# Altium schematic sheet Main.SchDoc
size 711 x 762 mm; SheetNumber: 1; SheetTotal: 1
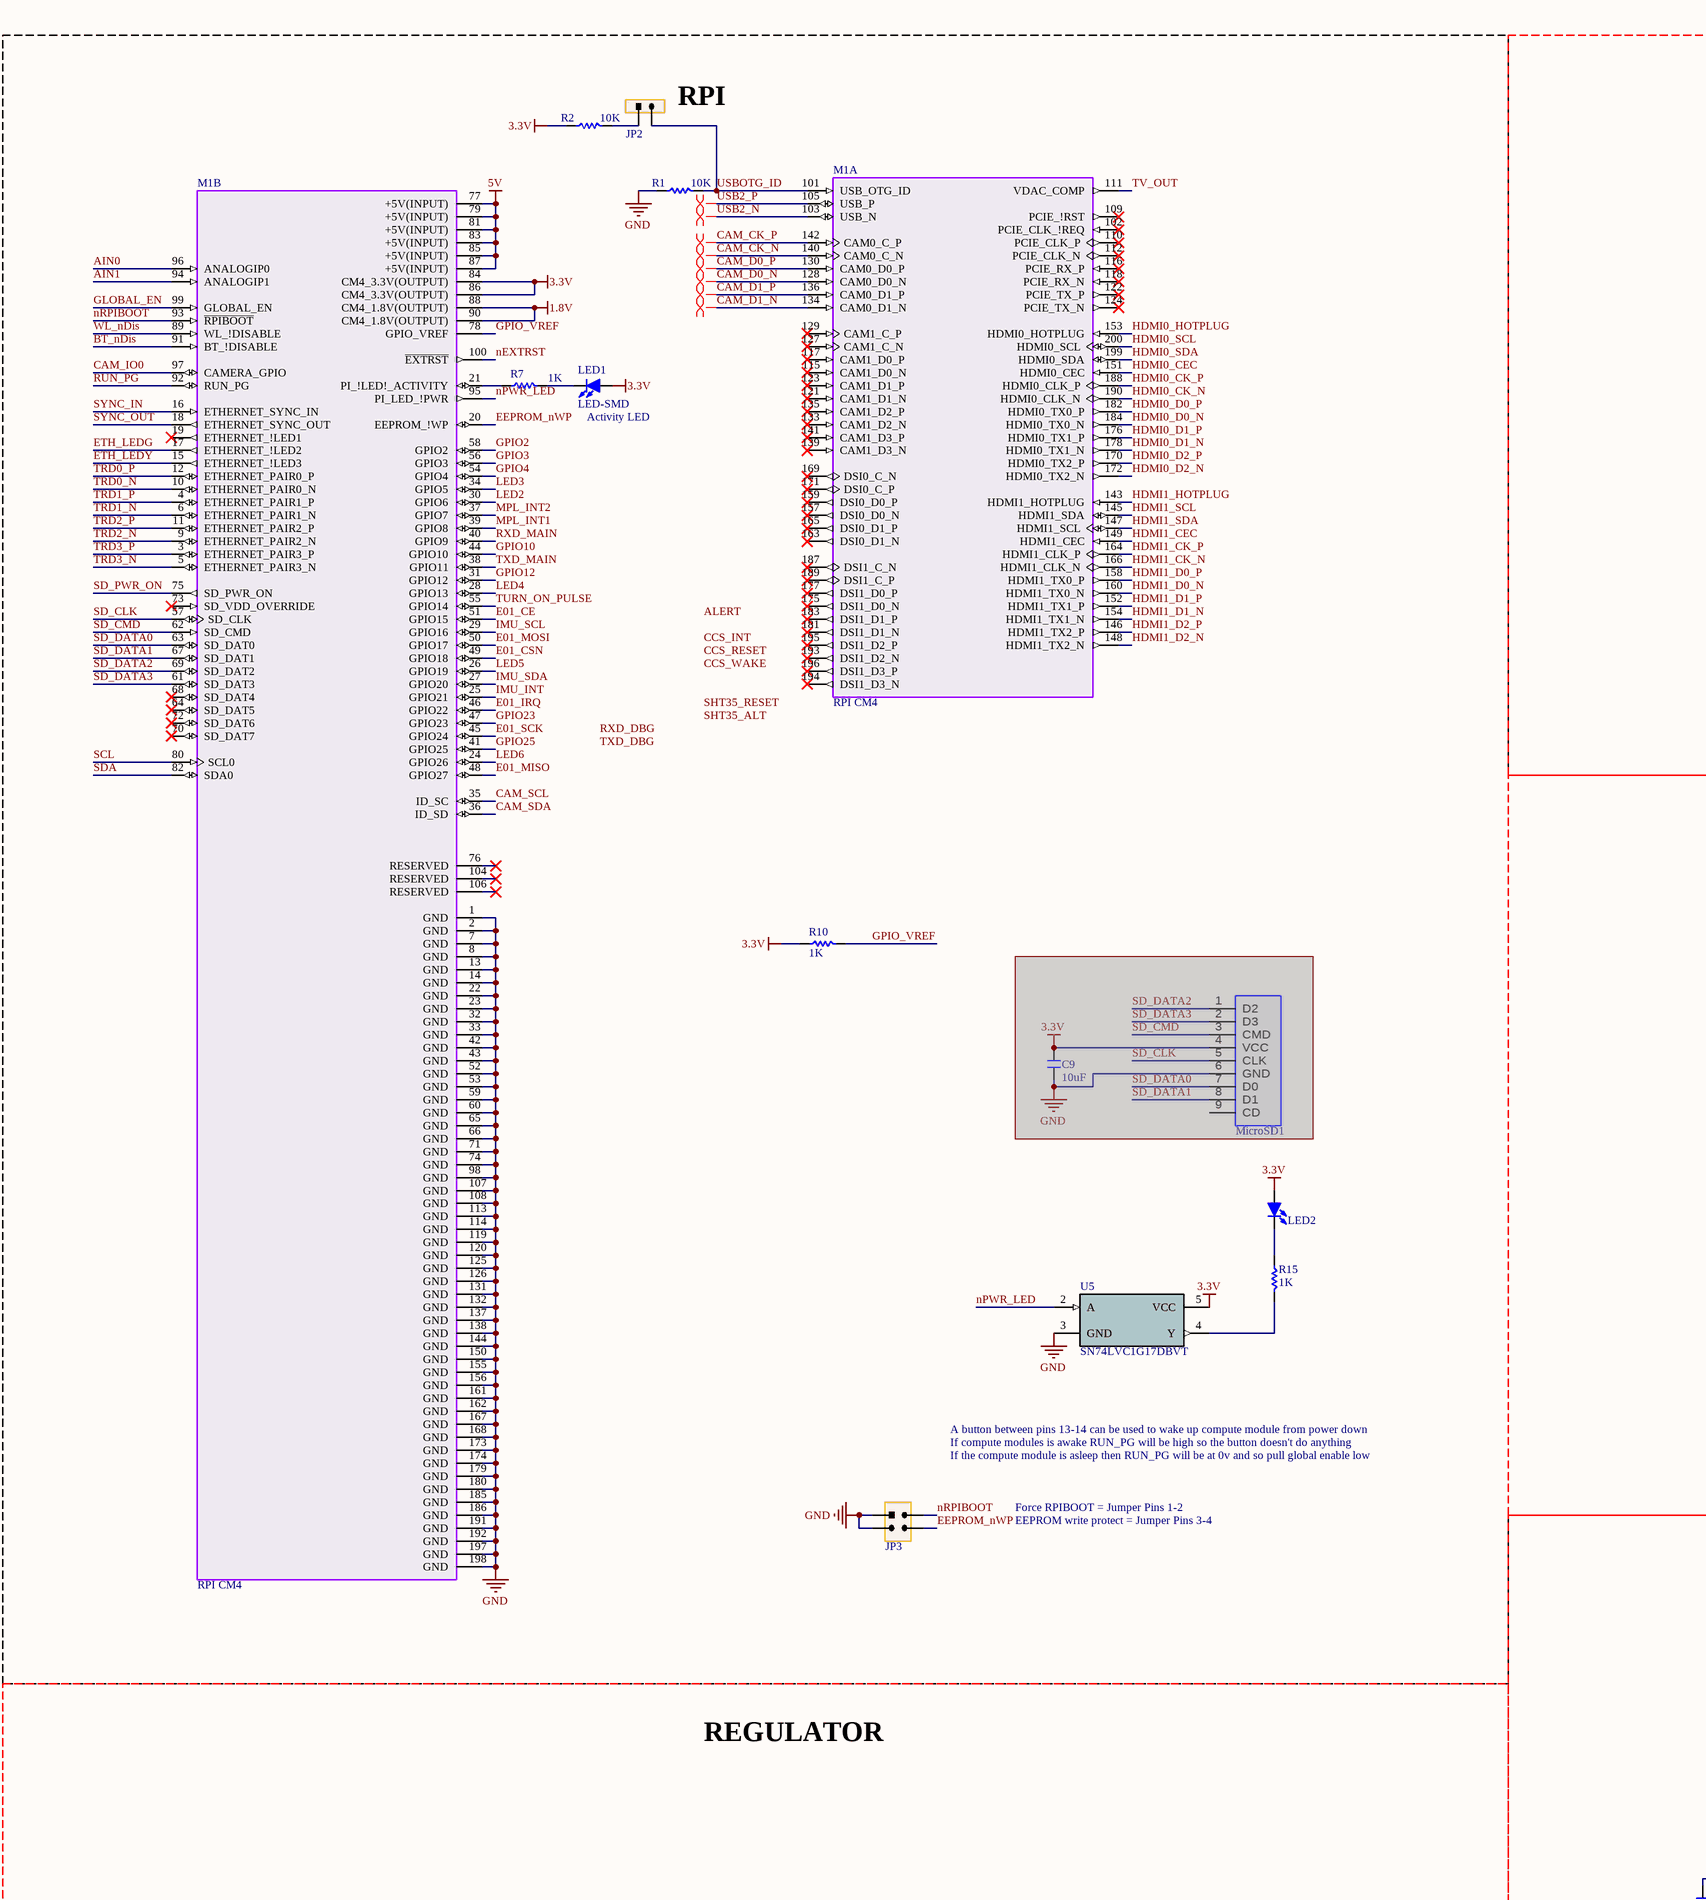
[diagram p0: Main.SchDoc, top left]
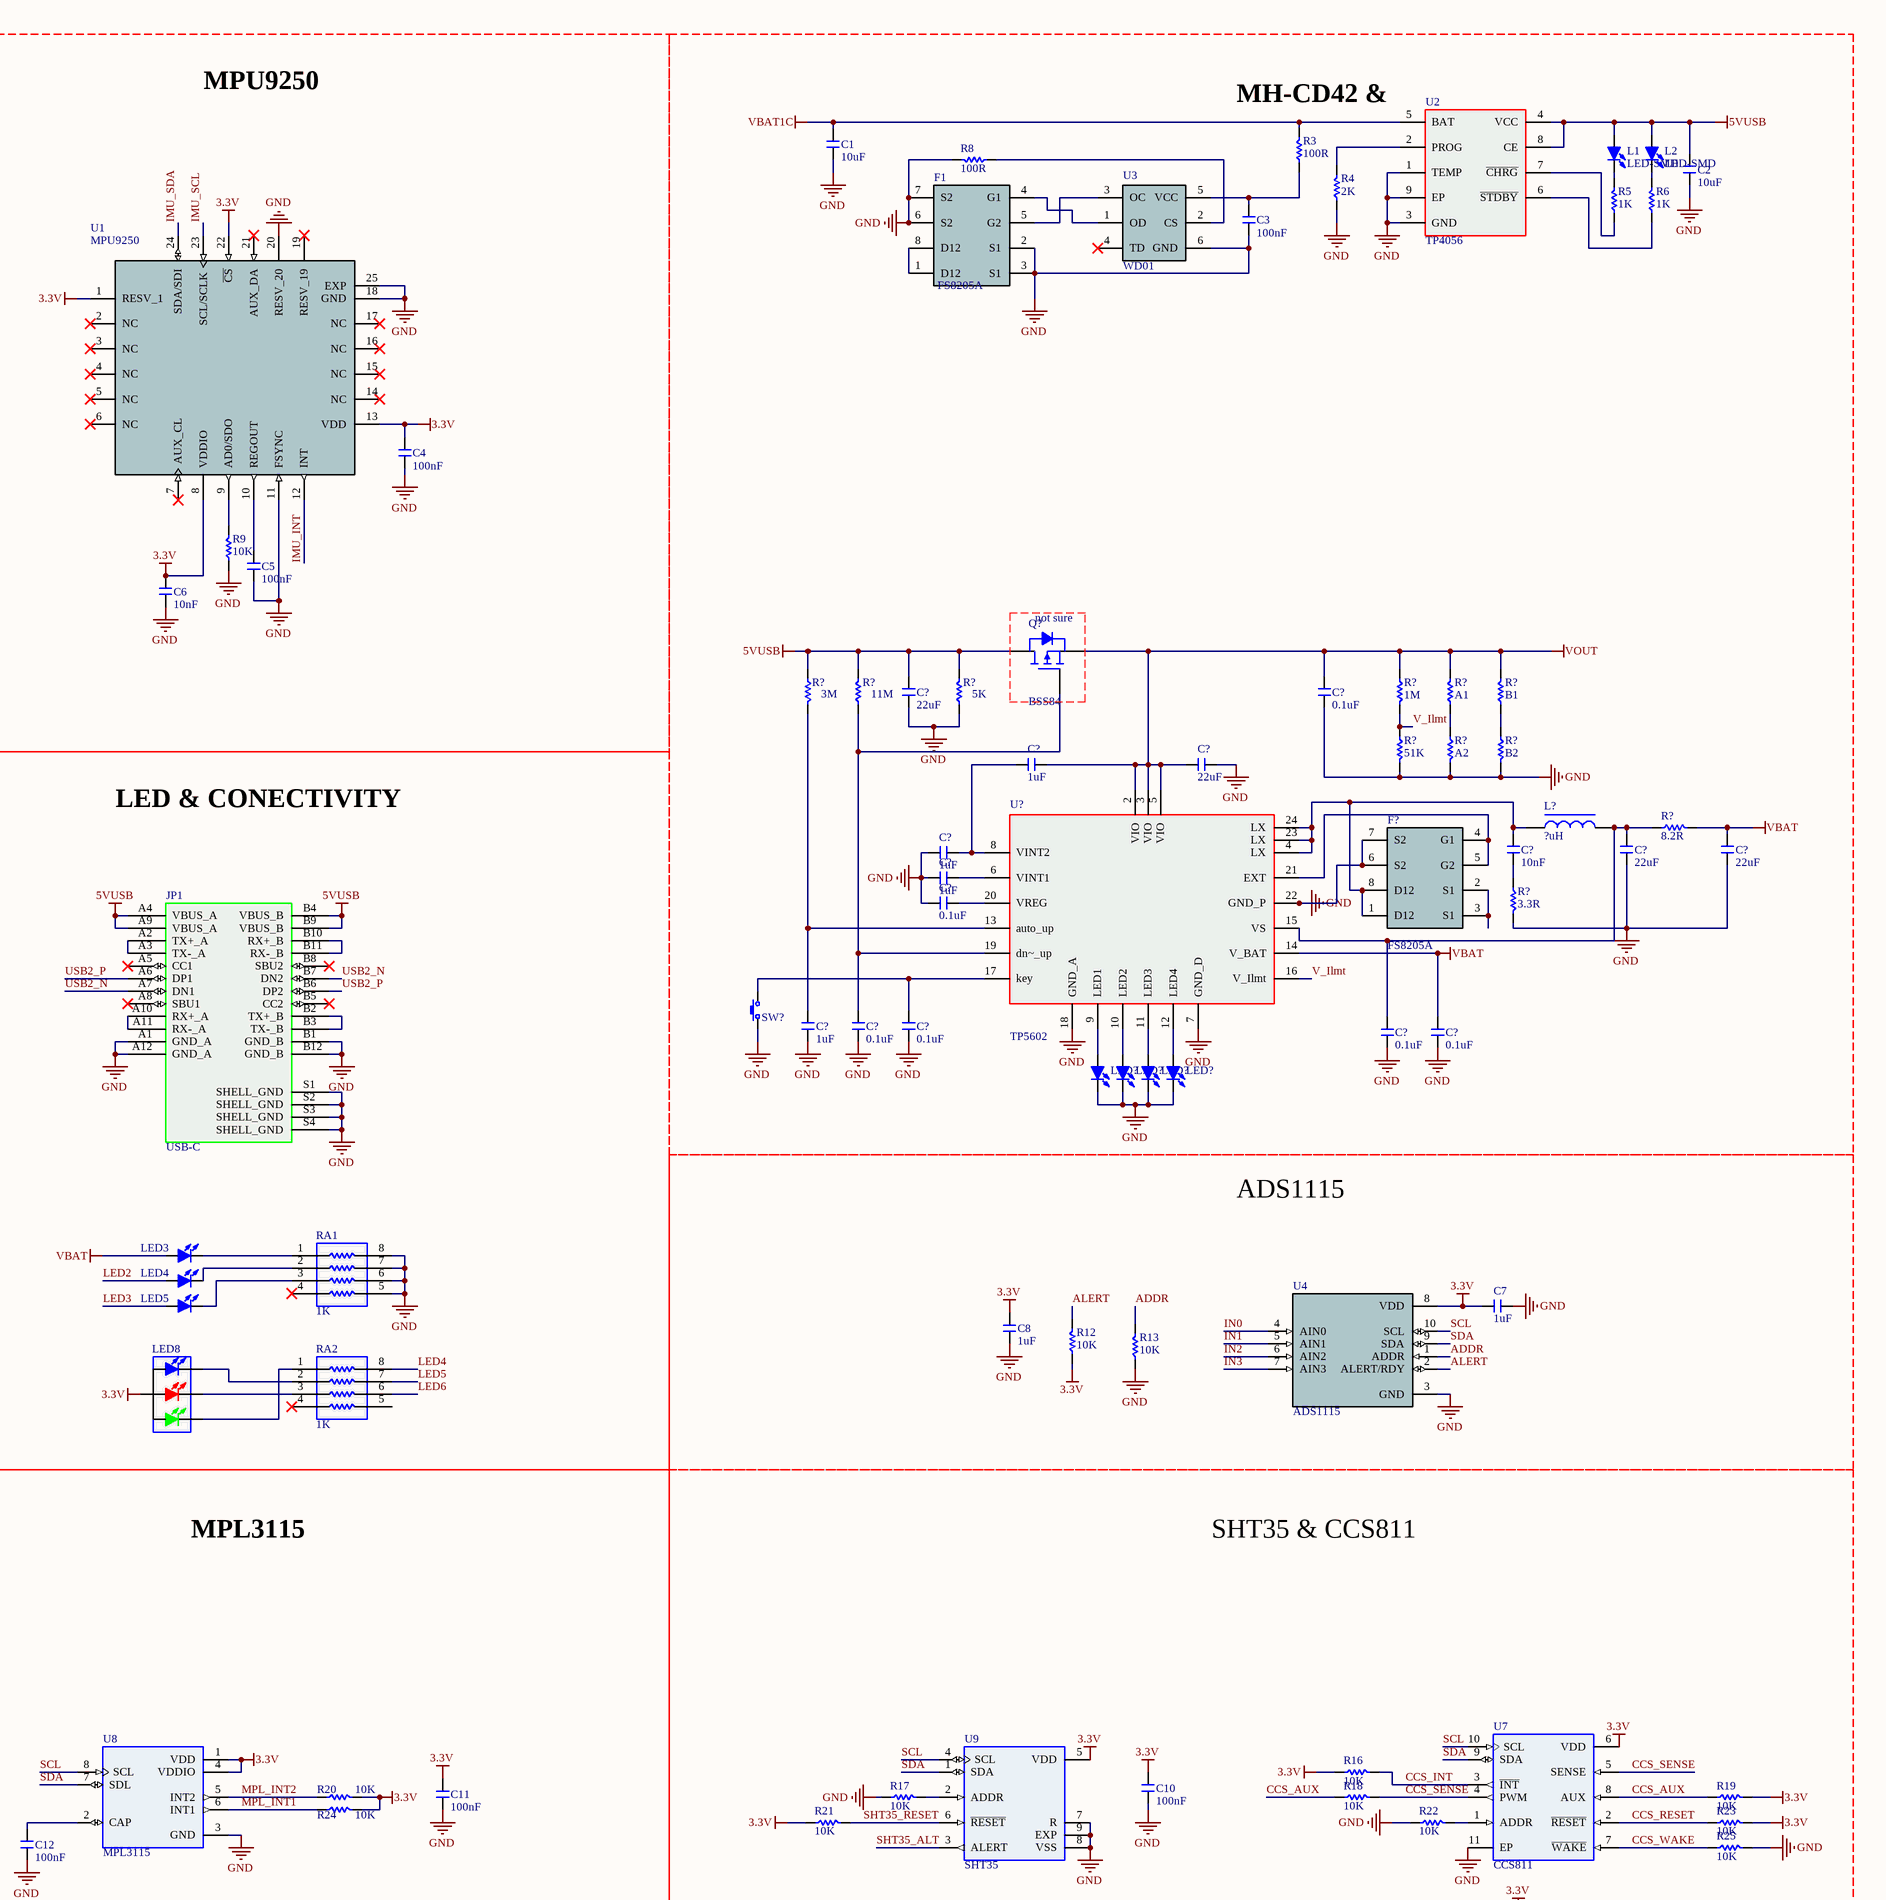
[diagram p1: Main.SchDoc, top right]
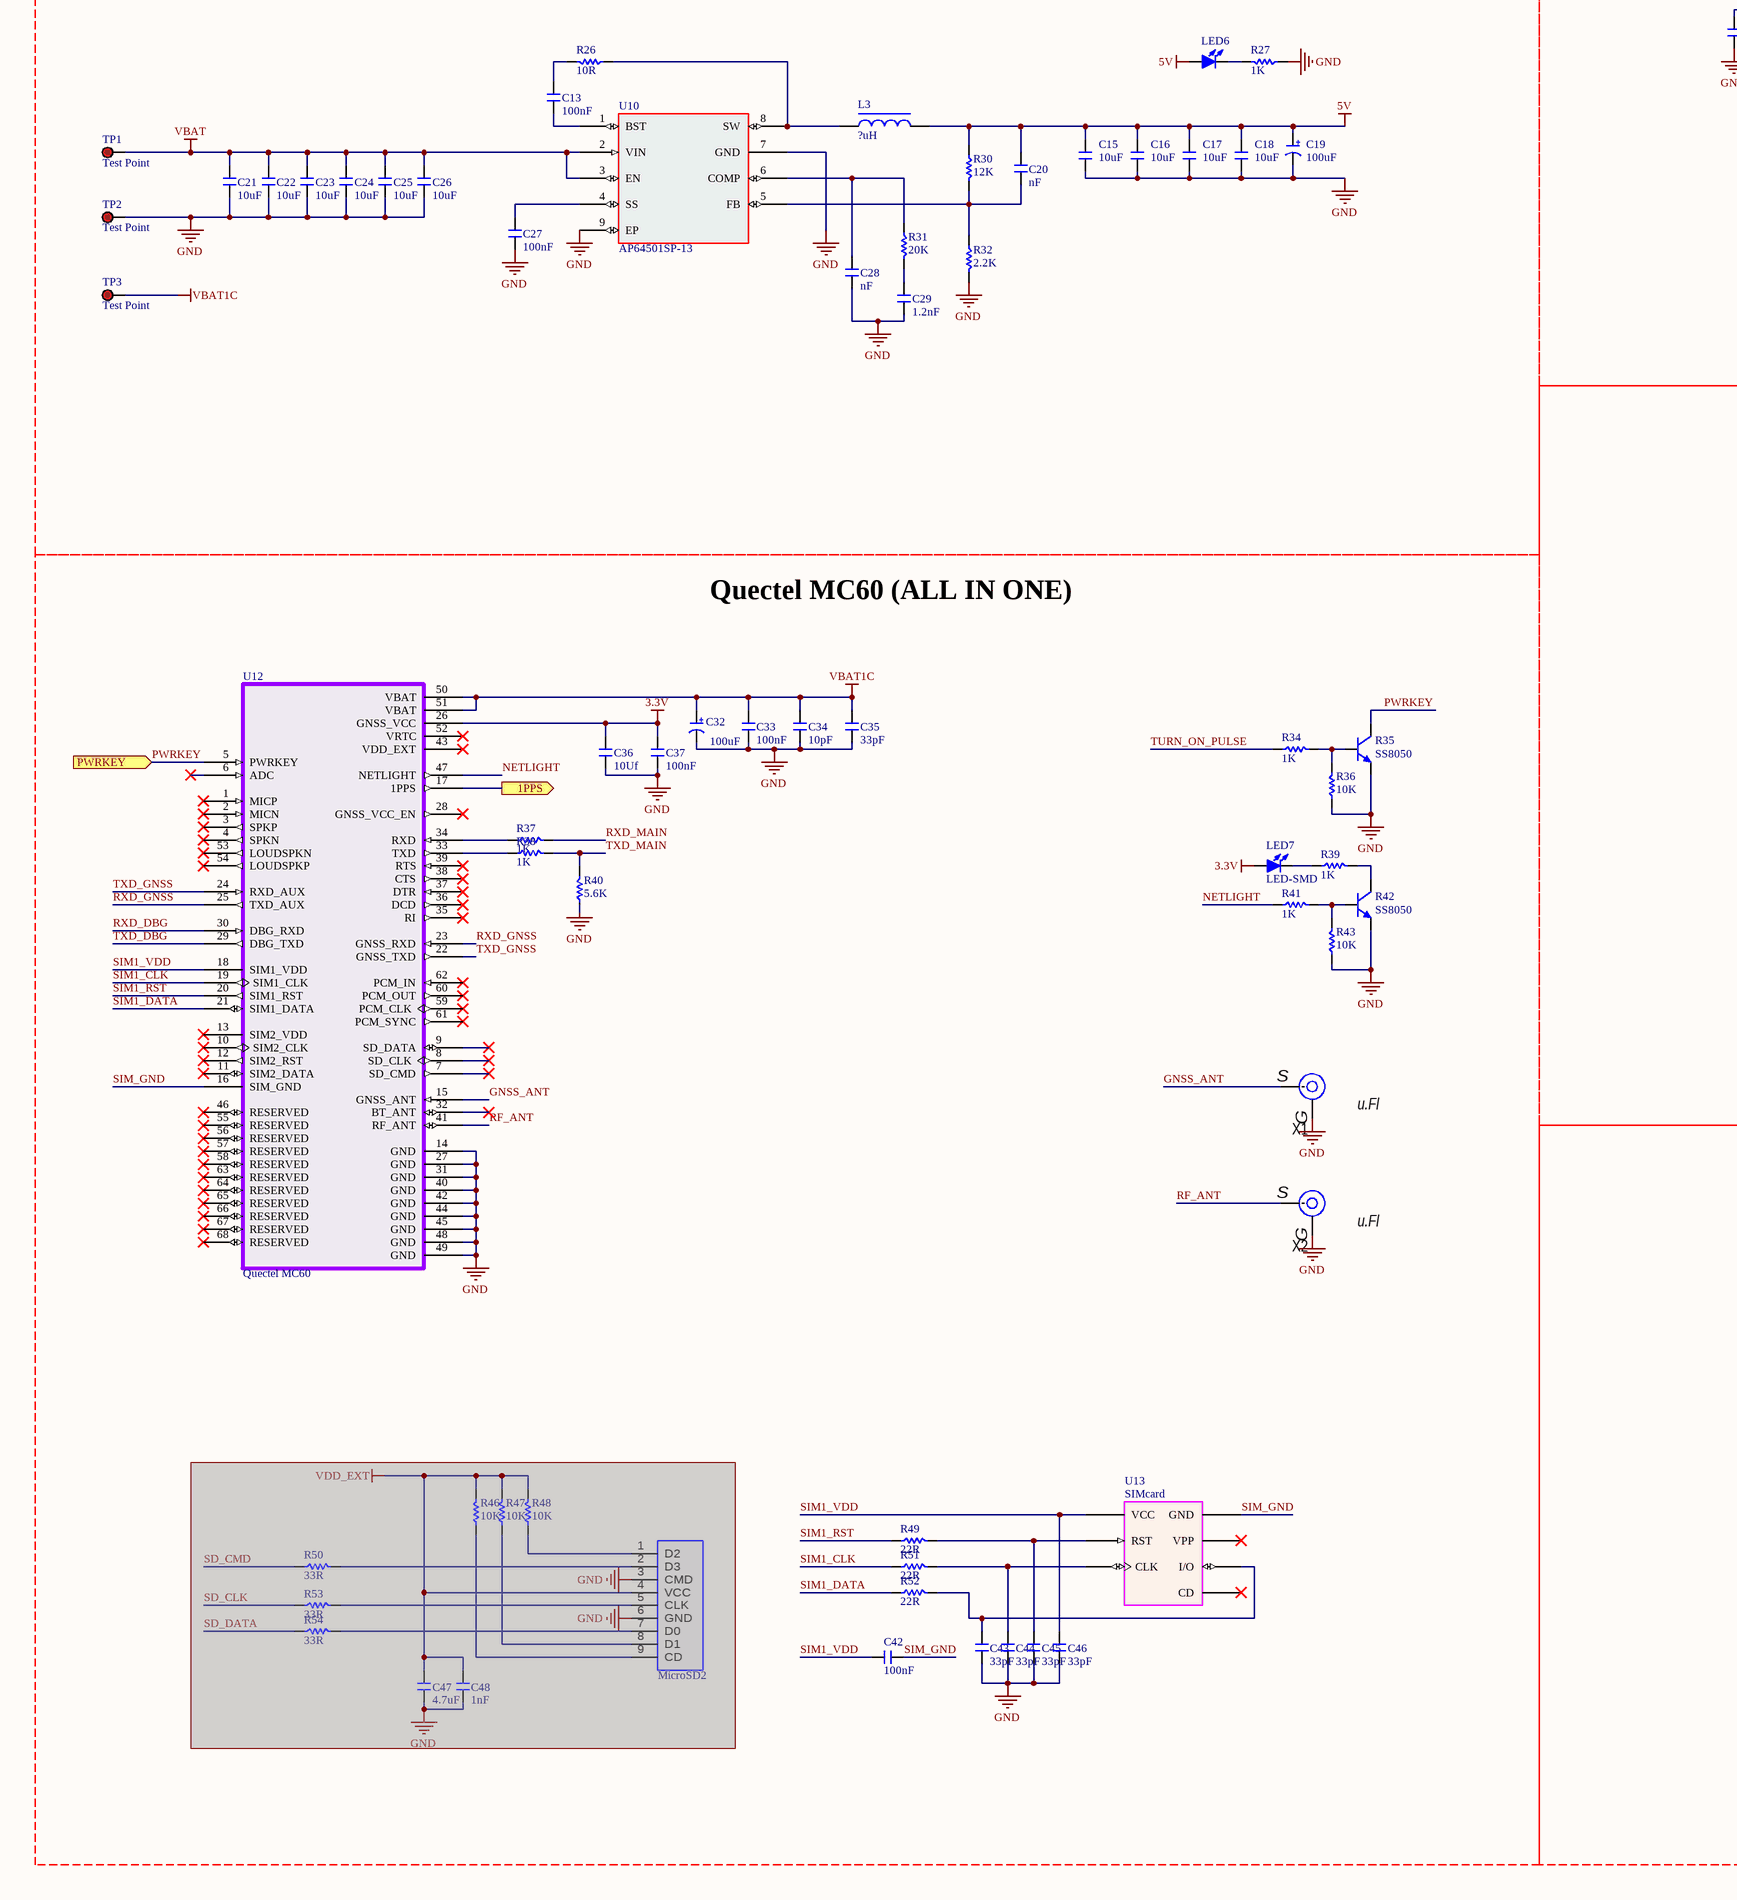
[diagram p2: Main.SchDoc, bottom left]
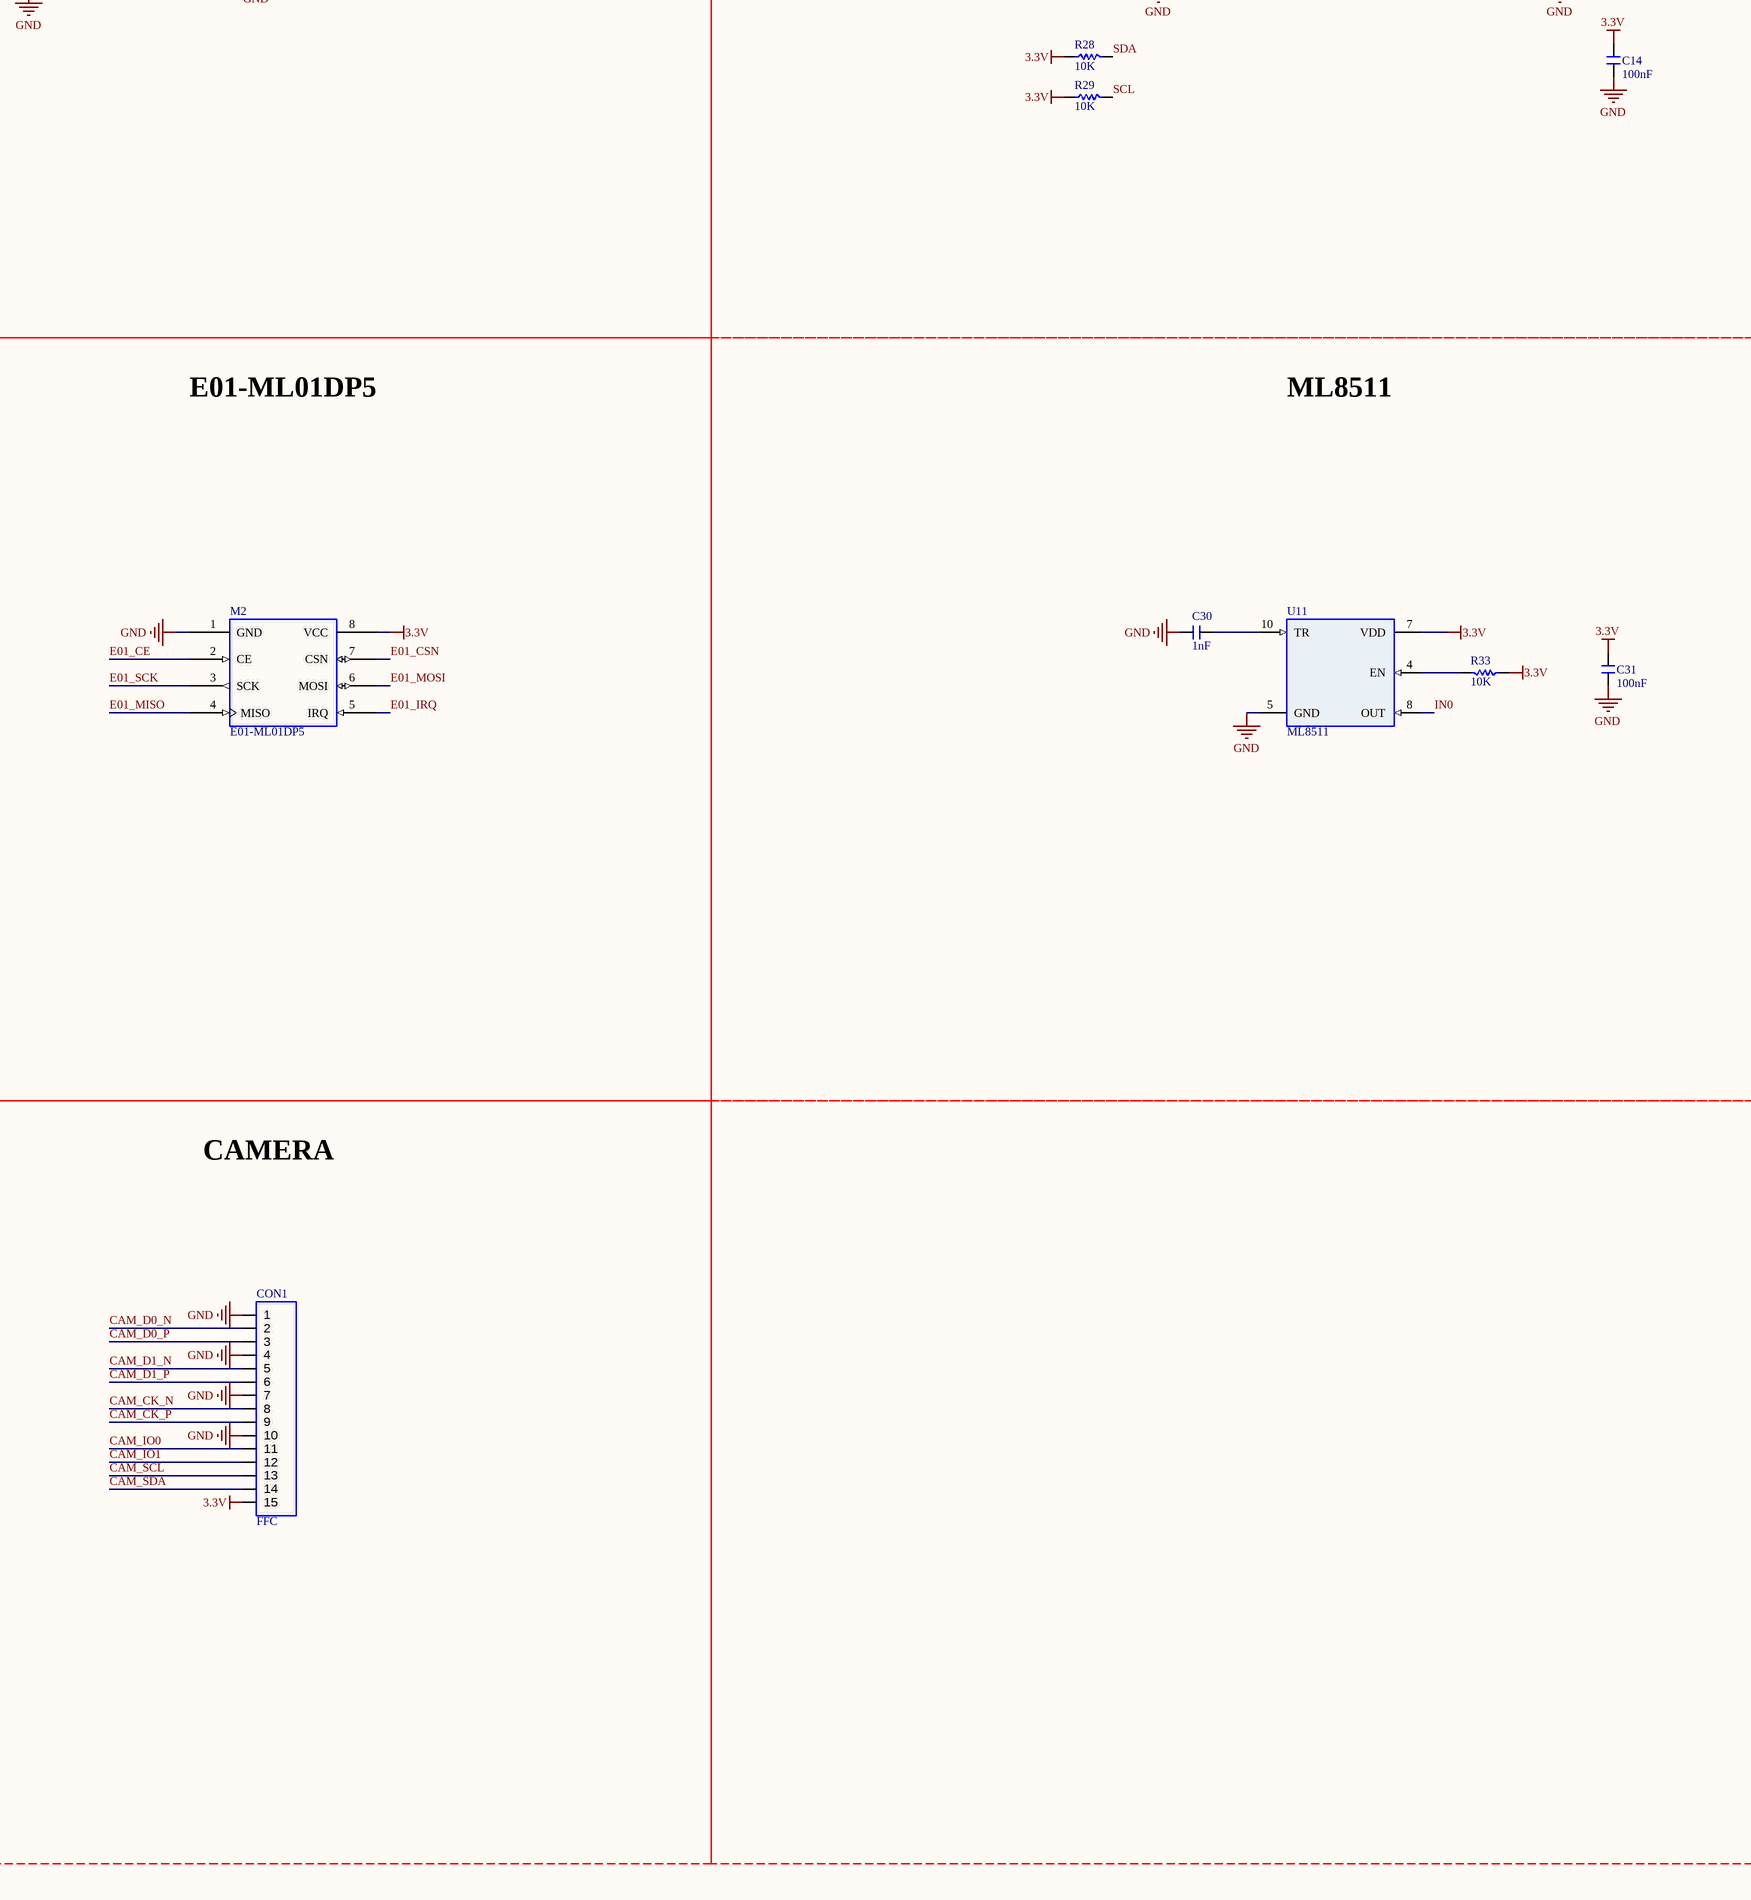
[diagram p3: Main.SchDoc, bottom right]

## Parts
(Parts that share a designator on the sheet are numbered #1, #2 ... from top to bottom, then left to right.)
C1  10uF  [C 0603]
C2  10uF  [C 0603]
C3  100nF  [C 0603]
C4  100nF  [C 0603]
C5  100nF  [C 0603]
C6  10nF  [C 0603]
C7  1uF  [C 0603]
C8  1uF  [C 0603]
C9  10uF  [C 0603]  (masked out: inside a compile mask, not in the netlist)
C10  100nF  [C 0603]
C11  100nF  [C 0603]
C12  100nF  [C 0603]
C13  100nF  [C 0603]
C14  100nF  [C 0603]
C15  10uF  [C 0805]
C16  10uF  [C 0805]
C17  10uF  [C 0805]
C18  10uF  [C 0805]
C19  100uF  [CD D(7343)]
C20  nF  [C 0603]
C21  10uF  [C 0805]
C22  10uF  [C 0805]
C23  10uF  [C 0805]
C24  10uF  [C 0805]
C25  10uF  [C 0805]
C26  10uF  [C 0805]
C27  100nF  [C 0603]
C28  nF  [C 0603]
C29  1.2nF  [C 0603]
C30  1nF  [C 0603]
C31  100nF  [C 0603]
C32  100uF  [CD C(6032)]
C33  100nF  [C 0603]
C34  10pF  [C 0603]
C35  33pF  [C 0603]
C36  10Uf  [C 0603]
C37  100nF  [C 0603]
C42  100nF  [C 0603]
C43  33pF  [C 0603]
C44  33pF  [C 0603]
C45  33pF  [C 0603]
C46  33pF  [C 0603]
C47  4.7uF  [C 0603]  (masked out: inside a compile mask, not in the netlist)
C48  1nF  [C 0603]  (masked out: inside a compile mask, not in the netlist)
C?#1  22uF  [C 0805]
C?#2  0.1uF  [C 0603]
C?#3  1uF  [C 0603]
C?#4  22uF  [C 0603]
C?#5  10nF  [C 0603]
C?#6  22uF  [C 0603]
C?#7  22uF  [C 0603]
C?#8  1uF  [C 0603]
C?#9  1uF  [C 0603]
C?#10  0.1uF  [C 0603]
C?#11  1uF  [C 0603]
C?#12  0.1uF  [C 0603]
C?#13  0.1uF  [C 0603]
C?#14  0.1uF  [C 0805]
C?#15  0.1uF  [C 0805]
CON1  FFC  [FFC_0.5_15]
F1  FS8205A  [SSOP8_L]
F?  FS8205A  [SSOP8_L]
JP1  USB-C  [USB-C-RIGHT]
JP2  HDR-1X2  [HDR-1X2]  (value not drawn)
JP3  Header2X2  [HDR-2X2]  (value not drawn)
L1  LED-SMD  [LED 0603R]
L2  LED-SMD  [LED 0603R]
L3  ?uH  [CD53]
L?  ?uH  [CD73]
LED1  LED-SMD  [LED 0603Y]
LED2  LED-SMD  [LED 0603R]  (value not drawn)
LED3  红色  [LED 3MM-B]  (value not drawn)
LED4  红色  [LED 3MM-B]  (value not drawn)
LED5  红色  [LED 3MM-B]  (value not drawn)
LED6  LED-SMD  [LED 0603R]  (value not drawn)
LED7  LED-SMD  [LED 0603Y]
LED8  LED RGB_A  [RGB-3528-A]  (value not drawn)
LED?#1  RED  [LED 0603R]  (value not drawn)
LED?#2  BLUE  [LED 0603B]  (value not drawn)
LED?#3  GREEN  [LED 0603G]  (value not drawn)
LED?#4  YELLOW  [LED 0603Y]  (value not drawn)
M1  RPI CM4  [CM4]  (parts A,B of 2)
M2  E01-ML01DP5  [E01-ML01DP5]
MicroSD1  MicroSD Card  [micro SD Card]  (value not drawn)  (masked out: inside a compile mask, not in the netlist)
MicroSD2  MicroSD Card  [micro SD Card]  (value not drawn)  (masked out: inside a compile mask, not in the netlist)
Q?  BSS84  [SOT23-3L]
R1  10K  [R 0603]
R2  10K  [R 0603]
R3  100R  [R 0603]
R4  2K  [R 0603]
R5  1K  [R 0603]
R6  1K  [R 0603]
R7  1K  [R 0603]
R8  100R  [R 0603]
R9  10K  [R 0603]
R10  1K  [R 0603]
R12  10K  [R 0603]
R13  10K  [R 0603]
R15  1K  [R 0603]
R16  10K  [R 0603]
R17  10K  [R 0603]
R18  10K  [R 0603]
R19  10K  [R 0603]
R20  10K  [R 0603]
R21  10K  [R 0603]
R22  10K  [R 0603]
R23  10K  [R 0603]
R24  10K  [R 0603]
R25  10K  [R 0603]
R26  10R  [R 0603]
R27  1K  [R 0603]
R28  10K  [R 0603]
R29  10K  [R 0603]
R30  12K  [R 0603]
R31  20K  [R 0603]
R32  2.2K  [R 0603]
R33  10K  [R 0603]
R34  1K  [R 0603]
R35  SS8050  [SOT23-3N]
R36  10K  [R 0603]
R37  1K  [R 0603]
R38  1K  [R 0603]
R39  1K  [R 0603]
R40  5.6K  [R 0603]
R41  1K  [R 0603]
R42  SS8050  [SOT23-3N]
R43  10K  [R 0603]
R46  10K  [R 0603]  (masked out: inside a compile mask, not in the netlist)
R47  10K  [R 0603]  (masked out: inside a compile mask, not in the netlist)
R48  10K  [R 0603]  (masked out: inside a compile mask, not in the netlist)
R49  22R  [R 0603]
R50  33R  [R 0603]  (masked out: inside a compile mask, not in the netlist)
R51  22R  [R 0603]
R52  22R  [R 0603]
R53  33R  [R 0603]  (masked out: inside a compile mask, not in the netlist)
R54  33R  [R 0603]  (masked out: inside a compile mask, not in the netlist)
R?#1  3M  [R 0603]
R?#2  1M  [R 0603]
R?#3  11M  [R 0603]
R?#4  5K  [R 0603]
R?#5  A1  [R 0603]
R?#6  B1  [R 0603]
R?#7  51K  [R 0603]
R?#8  A2  [R 0603]
R?#9  B2  [R 0603]
R?#10  8.2R  [R 1210]
R?#11  3.3R  [R 0603]
RA1  1K  [RA1206 (4x0603)]
RA2  1K  [RA1206 (4x0603)]
SW?  3x6x5  [TSW SMD-3*6*2.5]  (value not drawn)
TP1  Test Point  [TEST_POINT_40MIL_R]
TP2  Test Point  [TEST_POINT_40MIL_R]
TP3  Test Point  [TEST_POINT_40MIL_R]
U1  MPU9250  [QFN40-25N]
U2  TP4056  [SOP8_M-EP]
U3  WD01  [SOT23-6M]
U4  ADS1115  [VSSOP10-N]
U5  SN74LVC1G17DBVT  [SOT23-5M]
U7  CCS811  [CCS811]
U8  MPL3115  [MPL3115]
U9  SHT35  [SHT35]
U10  AP64501SP-13  [SOP8_M-EP]
U11  ML8511  [ML8511]
U12  Quectel MC60  [Quectel MC60]
U13  SIMcard  [SIMcard_6pin_1]
U?  TP5602
X1  u.Fl  [u.Fl 3P]
X2  u.Fl  [u.Fl 3P]

## Ports
1PPS (out), PWRKEY (in)

## Nets
1.8V: M1.88(CM4_1.8V(OUTPUT)) M1.90(CM4_1.8V(OUTPUT))
3.3V: C4.1 C6.1 C7.1 C8.2 C10.1 C11.2 C14.1 C31.2 C36.1 C37.1 CON1.15 LED1.1(A) LED2.1(A) LED7.1(A) LED8.3(RED_A) M1.84(CM4_3.3V(OUTPUT)) M1.86(CM4_3.3V(OUTPUT)) M2.8(VCC) R2.1 R10.1 R12.1 R16.1 R19.2 R20.2 R21.1 R23.2 R24.2 R28.1 R29.1 R33.1 U1.1(RESV_1) U1.8(VDDIO) U1.13(VDD) U1.22(~{CS}) U4.8(VDD) U5.5(VCC) U7.6(VDD) U8.1(VDD) U8.4(VDDIO) U9.5(VDD) U11.7(VDD) U12.26(GNSS_VCC)
5V: C15.1 C16.1 C17.1 C18.1 C19.1(A) C20.1 L3.2 LED6.1(A) M1.77(+5V(INPUT)) M1.79(+5V(INPUT)) M1.81(+5V(INPUT)) M1.83(+5V(INPUT)) M1.85(+5V(INPUT)) M1.87(+5V(INPUT)) R30.1
5VUSB: C2.2 C?#1.1 JP1.A4(VBUS_A) JP1.A9(VBUS_A) JP1.B4(VBUS_B) JP1.B9(VBUS_B) L1.1(A) L2.1(A) Q?.3(D) R?#1.1 R?#3.2 R?#4.2 U2.4(VCC) U2.8(CE)
GND: C1.1 C2.1 C3.1 C4.2 C5.2 C6.2 C7.2 C8.1 C10.2 C11.1 C12.1 C14.2 C15.2 C16.2 C17.2 C18.2 C19.2(K) C21.2 C22.2 C23.2 C24.2 C25.2 C26.2 C27.2 C28.2 C29.2 C30.1 C31.1 C32.2(K) C33.2 C34.2 C35.2 C36.2 C37.2 C43.2 C44.2 C45.2 C46.2 C?#1.2 C?#2.2 C?#4.2 C?#6.2 C?#7.2 C?#8.2 C?#9.2 C?#10.2 C?#11.2 C?#12.2 C?#13.2 C?#14.2 C?#15.2 CON1.1 CON1.4 CON1.7 CON1.10 F1.2(S1) F1.3(S1) F1.6(S2) F1.7(S2) F?.6(S2) F?.7(S2) JP1.A1(GND_A) JP1.A12(GND_A) JP1.B1(GND_B) JP1.B12(GND_B) JP1.S1(SHELL_GND) JP1.S2(SHELL_GND) JP1.S3(SHELL_GND) JP1.S4(SHELL_GND) JP3.1 JP3.3 LED?#1.2(K) LED?#2.2(K) LED?#3.2(K) LED?#4.2(K) M1.1(GND) M1.2(GND) M1.7(GND) M1.8(GND) M1.13(GND) M1.14(GND) M1.22(GND) M1.23(GND) M1.32(GND) M1.33(GND) M1.42(GND) M1.43(GND) M1.52(GND) M1.53(GND) M1.59(GND) M1.60(GND) M1.65(GND) M1.66(GND) M1.71(GND) M1.74(GND) M1.98(GND) M1.107(GND) M1.108(GND) M1.113(GND) M1.114(GND) M1.119(GND) M1.120(GND) M1.125(GND) M1.126(GND) M1.131(GND) M1.132(GND) M1.137(GND) M1.138(GND) M1.144(GND) M1.150(GND) M1.155(GND) M1.156(GND) M1.161(GND) M1.162(GND) M1.167(GND) M1.168(GND) M1.173(GND) M1.174(GND) M1.179(GND) M1.180(GND) M1.185(GND) M1.186(GND) M1.191(GND) M1.192(GND) M1.197(GND) M1.198(GND) M2.1(GND) R1.1 R4.1 R8.2 R9.1 R13.1 R17.1 R22.1 R25.2 R27.1 R32.2 R35.2(E) R36.1 R40.1 R42.2(E) R43.1 R?#4.1 R?#7.2 R?#8.2 R?#9.2 R?#11.2 RA1.5 RA1.6 RA1.7 RA1.8 SW?.1 TP2.1 U1.11(FSYNC) U1.18(GND) U1.20(RESV_20) U1.25(EXP) U2.1(TEMP) U2.3(GND) U2.9(EP) U3.6(GND) U4.3(GND) U5.3(GND) U7.11(EP) U8.3(GND) U9.7(R) U9.8(VSS) U9.9(EXP) U10.7(GND) U10.9(EP) U11.5(GND) U12.14(GND) U12.27(GND) U12.31(GND) U12.40(GND) U12.42(GND) U12.44(GND) U12.45(GND) U12.48(GND) U12.49(GND) U?.7(GND_D) U?.18(GND_A) U?.22(GND_P) X1.G(GND) X2.G(GND)
VBAT: C21.1 C22.1 C23.1 C24.1 C25.1 C26.1 C?#7.1 C?#15.1 LED3.1(A) R?#10.2 TP1.1 U10.2(VIN) U10.3(EN) U?.14(V_BAT)
VBAT1C: C1.2 C32.1(A) C33.1 C34.1 C35.1 R3.2 TP3.1 U2.5(BAT) U12.50(VBAT) U12.51(VBAT)
VOUT: C?#2.1 C?#3.1 C?#4.1 Q?.2(S) R?#2.1 R?#5.2 R?#6.2 U?.2(VIO) U?.3(VIO) U?.5(VIO)
1PPS: U12.17(1PPS) ; port 1PPS
ADDR: R13.2 U4.1(ADDR)
AIN0: M1.96(ANALOGIP0)
AIN1: M1.94(ANALOGIP1)
ALERT: R12.2 U4.2(ALERT/RDY)
BT_nDis: M1.91(BT_!DISABLE)
CAM_CK_N: CON1.8 M1.140(CAM0_C_N)
CAM_CK_P: CON1.9 M1.142(CAM0_C_P)
CAM_D0_N: CON1.2 M1.128(CAM0_D0_N)
CAM_D0_P: CON1.3 M1.130(CAM0_D0_P)
CAM_D1_N: CON1.5 M1.134(CAM0_D1_N)
CAM_D1_P: CON1.6 M1.136(CAM0_D1_P)
CAM_IO0: CON1.11 M1.97(CAMERA_GPIO)
CAM_IO1: CON1.12
CAM_SCL: CON1.13 M1.35(ID_SC)
CAM_SDA: CON1.14 M1.36(ID_SD)
CCS_AUX: R18.1 R19.1 U7.8(AUX)
CCS_INT: R16.2 U7.3(~{INT})
CCS_RESET: R23.1 U7.2(~{RESET})
CCS_SENSE: R18.2 U7.4(PWM) U7.5(SENSE)
CCS_WAKE: R25.1 U7.7(~{WAKE})
E01_CE: M1.51(GPIO15) M2.2(CE)
E01_CSN: M1.49(GPIO18) M2.7(CSN)
E01_IRQ: M1.46(GPIO22) M2.5(IRQ)
E01_MISO: M1.48(GPIO27) M2.4(MISO)
E01_MOSI: M1.50(GPIO17) M2.6(MOSI)
E01_SCK: M1.45(GPIO24) M2.3(SCK)
EEPROM_nWP: JP3.4 M1.20(EEPROM_!WP)
ETH_LEDG: M1.17(ETHERNET_!LED2)
ETH_LEDY: M1.15(ETHERNET_!LED3)
GLOBAL_EN: M1.99(GLOBAL_EN)
GNSS_ANT: U12.15(GNSS_ANT) X1.S(Signal)
GPIO2: M1.58(GPIO2)
GPIO3: M1.56(GPIO3)
GPIO4: M1.54(GPIO4)
GPIO10: M1.44(GPIO10)
GPIO12: M1.31(GPIO12)
GPIO23: M1.47(GPIO23)
GPIO25: M1.41(GPIO25)
GPIO_VREF: M1.78(GPIO_VREF) R10.2
HDMI0_CEC: M1.151(HDMI0_CEC)
HDMI0_CK_N: M1.190(HDMI0_CLK_N)
HDMI0_CK_P: M1.188(HDMI0_CLK_P)
HDMI0_D0_N: M1.184(HDMI0_TX0_N)
HDMI0_D0_P: M1.182(HDMI0_TX0_P)
HDMI0_D1_N: M1.178(HDMI0_TX1_N)
HDMI0_D1_P: M1.176(HDMI0_TX1_P)
HDMI0_D2_N: M1.172(HDMI0_TX2_N)
HDMI0_D2_P: M1.170(HDMI0_TX2_P)
HDMI0_HOTPLUG: M1.153(HDMI0_HOTPLUG)
HDMI0_SCL: M1.200(HDMI0_SCL)
HDMI0_SDA: M1.199(HDMI0_SDA)
HDMI1_CEC: M1.149(HDMI1_CEC)
HDMI1_CK_N: M1.166(HDMI1_CLK_N)
HDMI1_CK_P: M1.164(HDMI1_CLK_P)
HDMI1_D0_N: M1.160(HDMI1_TX0_N)
HDMI1_D0_P: M1.158(HDMI1_TX0_P)
HDMI1_D1_N: M1.154(HDMI1_TX1_N)
HDMI1_D1_P: M1.152(HDMI1_TX1_P)
HDMI1_D2_N: M1.148(HDMI1_TX2_N)
HDMI1_D2_P: M1.146(HDMI1_TX2_P)
HDMI1_HOTPLUG: M1.143(HDMI1_HOTPLUG)
HDMI1_SCL: M1.145(HDMI1_SDA)
HDMI1_SDA: M1.147(HDMI1_SCL)
IMU_INT: M1.25(GPIO21) U1.12(INT)
IMU_SCL: M1.29(GPIO16) U1.23(SCL/SCLK)
IMU_SDA: M1.27(GPIO20) U1.24(SDA/SDI)
IN0: U4.4(AIN0) U11.8(OUT)
IN1: U4.5(AIN1)
IN2: U4.6(AIN2)
IN3: U4.7(AIN3)
LED2: LED4.1(A) M1.30(GPIO6)
LED3: LED5.1(A) M1.34(GPIO5)
LED4: M1.28(GPIO13) RA2.8
LED5: M1.26(GPIO19) RA2.7
LED6: M1.24(GPIO26) RA2.6
MPL_INT1: M1.39(GPIO8) R24.1 U8.6(INT1)
MPL_INT2: M1.37(GPIO7) R20.1 U8.5(INT2)
NETLIGHT: R41.1 U12.47(NETLIGHT)
nEXTRST: M1.100(~{EXTRST})
nPWR_LED: M1.95(PI_LED_!PWR) U5.2(A)
nRPIBOOT: JP3.2 M1.93(~{RPIBOOT})
PWRKEY: R35.3(C) U12.5(PWRKEY) ; port PWRKEY
RF_ANT: U12.41(RF_ANT) X2.S(Signal)
RUN_PG: M1.92(RUN_PG)
RXD_DBG: U12.30(DBG_RXD)
RXD_GNSS: U12.23(GNSS_RXD) U12.25(TXD_AUX)
RXD_MAIN: M1.40(GPIO9) R37.2
SCL: M1.80(SCL0) R29.2 U4.10(SCL) U7.10(SCL) U8.8(SCL) U9.4(SCL)
SD_CLK: M1.57(SD_CLK)
SD_CMD: M1.62(SD_CMD)
SD_DATA0: M1.63(SD_DAT0)
SD_DATA1: M1.67(SD_DAT1)
SD_DATA2: M1.69(SD_DAT2)
SD_DATA3: M1.61(SD_DAT3)
SD_PWR_ON: M1.75(SD_PWR_ON)
SDA: M1.82(SDA0) R28.2 U4.9(SDA) U7.9(SDA) U8.7(SDL) U9.1(SDA)
SHT35_ALT: U9.3(ALERT)
SHT35_RESET: R21.2 U9.6(~{RESET})
SIM1_CLK: R51.1 U12.19(SIM1_CLK)
SIM1_DATA: R52.1 U12.21(SIM1_DATA)
SIM1_RST: R49.1 U12.20(SIM1_RST)
SIM1_VDD: C42.1 C46.1 U12.18(SIM1_VDD) U13.C1(VCC)
SIM_GND: C42.2 U12.16(SIM_GND) U13.C5(GND)
SYNC_IN: M1.16(ETHERNET_SYNC_IN)
SYNC_OUT: M1.18(ETHERNET_SYNC_OUT)
TRD0_N: M1.10(ETHERNET_PAIR0_N)
TRD0_P: M1.12(ETHERNET_PAIR0_P)
TRD1_N: M1.6(ETHERNET_PAIR1_N)
TRD1_P: M1.4(ETHERNET_PAIR1_P)
TRD2_N: M1.9(ETHERNET_PAIR2_N)
TRD2_P: M1.11(ETHERNET_PAIR2_P)
TRD3_N: M1.5(ETHERNET_PAIR3_N)
TRD3_P: M1.3(ETHERNET_PAIR3_P)
TURN_ON_PULSE: M1.55(GPIO14) R34.1
TV_OUT: M1.111(VDAC_COMP)
TXD_DBG: U12.29(DBG_TXD)
TXD_GNSS: U12.22(GNSS_TXD) U12.24(RXD_AUX)
TXD_MAIN: M1.38(GPIO11) R38.2 R40.2
USB2_N: JP1.A7(DN1) JP1.B7(DN2) M1.103(USB_N)
USB2_P: JP1.A6(DP1) JP1.B6(DP2) M1.105(USB_P)
USBOTG_ID: JP2.2 M1.101(USB_OTG_ID) R1.2
V_Ilmt: R?#2.2 R?#7.1 U?.16(V_Ilmt)
WL_nDis: M1.89(WL_!DISABLE)
NetC3_2: C3.2 R3.1 U3.5(VCC)
NetC5_1: C5.1 U1.10(REGOUT)
NetC12_2: C12.2 U8.2(CAP)
NetC13_1: C13.1 R26.2
NetC13_2: C13.2 U10.1(BST)
NetC20_2: C20.2 R30.2 R32.1 U10.5(FB)
NetC27_1: C27.1 U10.4(SS)
NetC28_1: C28.1 R31.1 U10.6(COMP)
NetC29_1: C29.1 R31.2
NetC30_2: C30.2 U11.10(TR)
NetC43_1: C43.1 R52.2 U13.C7(I/O)
NetC44_1: C44.1 R51.2 U13.C3(CLK)
NetC45_1: C45.1 R49.2 U13.C2(RST)
NetC?#3_2: C?#3.2 C?#8.1 U?.8(VINT2)
NetC?#5_1: C?#5.1 F?.1(D12) F?.8(D12) L?.1 U?.4(LX) U?.23(LX) U?.24(LX)
NetC?#5_2: C?#5.2 R?#11.1
NetC?#6_1: C?#6.1 C?#14.1 L?.2 R?#10.1 U?.15(VS)
NetC?#9_1: C?#9.1 U?.6(VINT1)
NetC?#10_1: C?#10.1 U?.20(VREG)
NetC?#11_1: C?#11.1 R?#1.2 U?.13(auto_up)
NetC?#12_1: C?#12.1 Q?.1(G) R?#3.1 U?.19(dn~_up)
NetC?#13_1: C?#13.1 SW?.2 U?.17(key)
NetF1_1: F1.1(D12) F1.8(D12)
NetF1_4: F1.4(G1) U3.1(OD)
NetF1_5: F1.5(G2) U3.3(OC)
NetF?_2: F?.2(S1) F?.3(S1)
NetF?_4: F?.4(G1) F?.5(G2) U?.21(EXT)
NetJP1_A2: JP1.A2(TX+_A) JP1.A3(TX-_A)
NetJP1_A10: JP1.A10(RX+_A) JP1.A11(RX-_A)
NetJP1_B2: JP1.B2(TX+_B) JP1.B3(TX-_B)
NetJP1_B10: JP1.B10(RX+_B) JP1.B11(RX-_B)
NetJP2_1: JP2.1 R2.2
NetL1_2: L1.2(K) R5.2
NetL2_2: L2.2(K) R6.2
NetL3_1: L3.1 R26.1 U10.8(SW)
NetLED1_2: LED1.2(K) R7.2
NetLED2_2: LED2.2(K) R15.1
NetLED3_2: LED3.2(K) RA1.1
NetLED4_2: LED4.2(K) RA1.2
NetLED5_2: LED5.2(K) RA1.3
NetLED6_2: LED6.2(K) R27.2
NetLED7_2: LED7.2(K) R39.1
NetLED8_1: LED8.1(BULE_K) RA2.2
NetLED8_2: LED8.2(GREEN_K) RA2.1
NetLED8_4: LED8.4(RED_K) RA2.3
NetLED?#1_1: LED?#1.1(A) U?.9(LED1)
NetLED?#2_1: LED?#2.1(A) U?.10(LED2)
NetLED?#3_1: LED?#3.1(A) U?.11(LED3)
NetLED?#4_1: LED?#4.1(A) U?.12(LED4)
NetM1_21: M1.21(PI_!LED!_ACTIVITY) R7.1
NetR4_2: R4.2 U2.2(PROG)
NetR5_1: R5.1 U2.7(~{CHRG})
NetR6_1: R6.1 U2.6(~{STDBY})
NetR8_1: R8.1 U3.2(CS)
NetR9_2: R9.2 U1.9(AD0/SDO)
NetR15_2: R15.2 U5.4(Y)
NetR17_2: R17.2 U9.2(ADDR)
NetR22_2: R22.2 U7.1(ADDR)
NetR33_2: R33.2 U11.4(EN)
NetR34_2: R34.2 R35.1(B) R36.2
NetR37_1: R37.1 U12.34(RXD)
NetR38_1: R38.1 U12.33(TXD)
NetR39_2: R39.2 R42.3(C)
NetR41_2: R41.2 R42.1(B) R43.2
NetR?#5_1: R?#5.1 R?#8.1
NetR?#6_1: R?#6.1 R?#9.1

Not connected (* = marked no-connect by the designer): JP1 A5(CC1)* A8(SBU1)* B5(CC2)* B8(SBU2)*; M1 19(ETHERNET_!LED1)* 64(SD_DAT5)* 68(SD_DAT4)* 70(SD_DAT7)* 72(SD_DAT6)* 73(SD_VDD_OVERRIDE)* 76(RESERVED)* 102(PCIE_CLK_!REQ)* 104(RESERVED)* 106(RESERVED)* 109(PCIE_!RST)* 110(PCIE_CLK_P)* 112(PCIE_CLK_N)* 115(CAM1_D0_N)* 116(PCIE_RX_P)* 117(CAM1_D0_P)* 118(PCIE_RX_N)* 121(CAM1_D1_N)* 122(PCIE_TX_P)* 123(CAM1_D1_P)* 124(PCIE_TX_N)* 127(CAM1_C_N)* 129(CAM1_C_P)* 133(CAM1_D2_N)* 135(CAM1_D2_P)* 139(CAM1_D3_N)* 141(CAM1_D3_P)* 157(DSI0_D0_N)* 159(DSI0_D0_P)* 163(DSI0_D1_N)* 165(DSI0_D1_P)* 169(DSI0_C_N)* 171(DSI0_C_P)* 175(DSI1_D0_N)* 177(DSI1_D0_P)* 181(DSI1_D1_N)* 183(DSI1_D1_P)* 187(DSI1_C_N)* 189(DSI1_C_P)* 193(DSI1_D2_N)* 194(DSI1_D3_N)* 195(DSI1_D2_P)* 196(DSI1_D3_P)*; RA1 4*; RA2 4* 5; U1 2(NC)* 3(NC)* 4(NC)* 5(NC)* 6(NC)* 7(AUX_CL)* 14(NC)* 15(NC)* 16(NC)* 17(NC)* 19(RESV_19)* 21(AUX_DA)*; U3 4(TD)*; U12 1(MICP)* 2(MICN)* 3(SPKP)* 4(SPKN)* 6(ADC)* 7(SD_CMD)* 8(SD_CLK)* 9(SD_DATA)* 10(SIM2_CLK)* 11(SIM2_DATA)* 12(SIM2_RST)* 13(SIM2_VDD)* 28(GNSS_VCC_EN)* 32(BT_ANT)* 35(RI)* 36(DCD)* 37(DTR)* 38(CTS)* 39(RTS)* 43(VDD_EXT)* 46(RESERVED)* 52(VRTC)* 53(LOUDSPKN)* 54(LOUDSPKP)* 55(RESERVED)* 56(RESERVED)* 57(RESERVED)* 58(RESERVED)* 59(PCM_CLK)* 60(PCM_OUT)* 61(PCM_SYNC)* 62(PCM_IN)* 63(RESERVED)* 64(RESERVED)* 65(RESERVED)* 66(RESERVED)* 67(RESERVED)* 68(RESERVED)*; U13 C6(VPP)* CD*

## Layout directives
differential pair: CAM_CK_N, CAM_CK_P, CAM_D0_N, CAM_D0_P, CAM_D1_N, CAM_D1_P, USB2_N, USB2_P

## Notes on the sheet
- MPU9250
- (near JP2) RPI
- (near R3) MH-CD42 &
- (near LED1) Activity LED
- (near Q?) not sure
- LED & CONECTIVITY
- ADS1115
- A button between pins 13-14 can be used to wake up compute module from power down
- If compute modules is awake RUN_PG will be high so the button doesn't do anything
- If the compute module is asleep then RUN_PG will be at 0v and so pull global enable low
- Force RPIBOOT = Jumper Pins 1-2
- EEPROM write protect = Jumper Pins 3-4
- MPL3115
- SHT35 & CCS811
- REGULATOR
- E01-ML01DP5
- ML8511
- Quectel MC60 (ALL IN ONE)
- CAMERA
- Labels drawn without touching a wire or pin: ALERT, CCS_INT, CCS_RESET, CCS_WAKE, RXD_DBG, SHT35_ALT, SHT35_RESET, TXD_DBG
- (in symbol C-CD) +

## Library data of the parts
C1-C18 C20-C31 C33-C37 C42-C48 C?#1-C?#15 = C: Non-polar patch capacitor; BOM名称: 无极性贴片电容; 版权归属: 源创客; 学习资源: www.ooocke.com
C19 C32 = C-CD: Solid Tantalum Chip Capacitor, Standard T491 Series - Industrial Grade; Published: 17-Jul-2002; LatestRevisionDate: 19-Mar-2004; LatestRevisionNote: Silkscreen dimensions re-sized.; DatasheetDocument: Mar-2001; PackageDocument: Mar-2001; PackageReference: B; Publisher: Altium Limited; Code_JEITA: 3528-21; ComponentLink1Description: Manufacturer Link; ComponentLink1URL: http://www.kemet.com/; ComponentLink2Description: Datasheet; ComponentLink2URL: http://www.kemet.com/kemet/web/homepage/kechome.nsf/vapubfilesname/F3102TA.pdf/$file/F3102TA.pdf
CON1 = FFC_0.5_15
F1 F? = FS8205A: Dual N-Channel Enhancement Mode Power MOSFET
JP1 = USB-C-RIGHT
JP2 = Header 2: 2P Connector; BOM名称: 2P接插件; 版权归属: 源创客; 学习资源: www.ooocke.com
JP3 = Header 2X2: 2*2P Connector; BOM名称: 2*2P接插件; 版权归属: 源创客; 学习资源: www.ooocke.com
L1 L2 LED1 LED2 LED6 LED7 LED?#1-LED?#4 = LED-SMD: Patch LED; BOM名称: 贴片LED; 版权归属: 源创客; 学习资源: www.ooocke.com
L3 L? = L-CD: Chip power inductor; BOM名称: 功率电感; 版权归属: 源创客; 学习资源: www.ooocke.com
LED3-LED5 = LED-3MM: Plug-in LED; BOM名称: 插件LED; 版权归属: 源创客; 学习资源: www.ooocke.com
M1 = CM4
MicroSD1 MicroSD2 = MicroSD Card: MicroSD
Q? = BSS84: P-Channel Enhancement Mode Field-Effect Transistor
R1-R10 R12 R13 R15-R34 R36-R41 R43 R46-R54 R?#1-R?#11 = R: Chip resistor; 版权归属: 源创客; BOM名称: Chip resistor; 学习资源: www.ooocke.com
R35 R42 = 8050-SMD: High frequency amplification-NPN; BOM名称: 高频放大-NPN型; 版权归属: 源创客; 属性: 40V 1.5A 1W 100MHZ; 学习资源: www.ooocke.com
RA1 RA2 = R-ARR: 4 way Chip Resistor Array
SW? = TSW 3x6: 3x6 tact switch; BOM名称: 3x6轻触开关; 版权归属: 源创客; 学习资源: www.ooocke.com
U2 = TP4056: Lithium battery charge management; BOM名称: 锂电池充电管理; 版权归属: 源创客; 学习资源: www.ooocke.com
U3 = WD01: Lithium battery overcurrent protection IC; BOM名称: 过流保护IC; 版权归属: 源创客; 学习资源: www.ooocke.com
U4 = ADS1115: ADS111x Ultra-Small, Low-Power, I / 2C-Compatible, 860-SPS, 16-Bit ADCs / With Internal Reference, Oscillator, and Programmable Comparator; BOM名称: 数字电位器; 版权归属: 源创客; 学习资源: www.ooocke.com
U5 = SN74LVC1G17DBVT: Single 1.65-V to 5.5-V buffer with Schmitt-Trigger inputs
U8 = MPL3115: Pressure Sensor
U11 = ML8511: UV Sensor
U12 = MC60: Ultra-small LCC Quad-band GSM/GPRS/GNSS Module
U13 = SIMcard (6pin)
X1 X2 = u.Fl 3P: RF; Manufacturer: Hirose Electric Co Ltd; Model: U.FL-R-SMT(01); HelpURL: *; ComponentKind: *